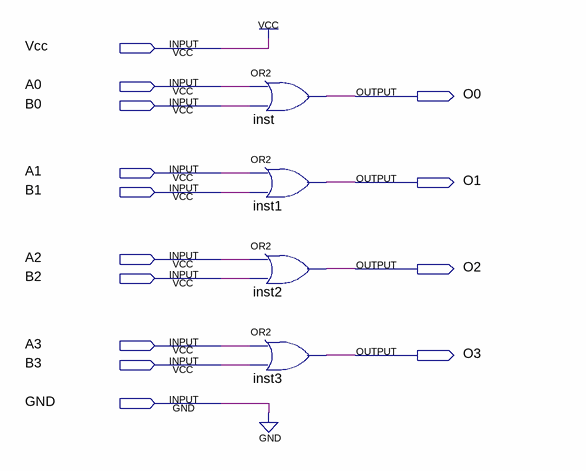
[diagram p0: schematic sheet]
// Quartus schematic 7432.bdf as structural Verilog: 4 symbols, 14 pins
module \7432  (
  input  Vcc,
  input  A0,
  input  B0,
  input  A1,
  input  B1,
  input  A2,
  input  B2,
  input  A3,
  input  B3,
  input  GND,
  output O0,
  output O1,
  output O2,
  output O3
);

  or inst (O0, A0, B0);
  or inst1 (O1, A1, B1);
  or inst2 (O2, A2, B2);
  or inst3 (O3, A3, B3);
  // also tied to GND on the sheet: GND
  // also tied to VCC on the sheet: Vcc
endmodule
